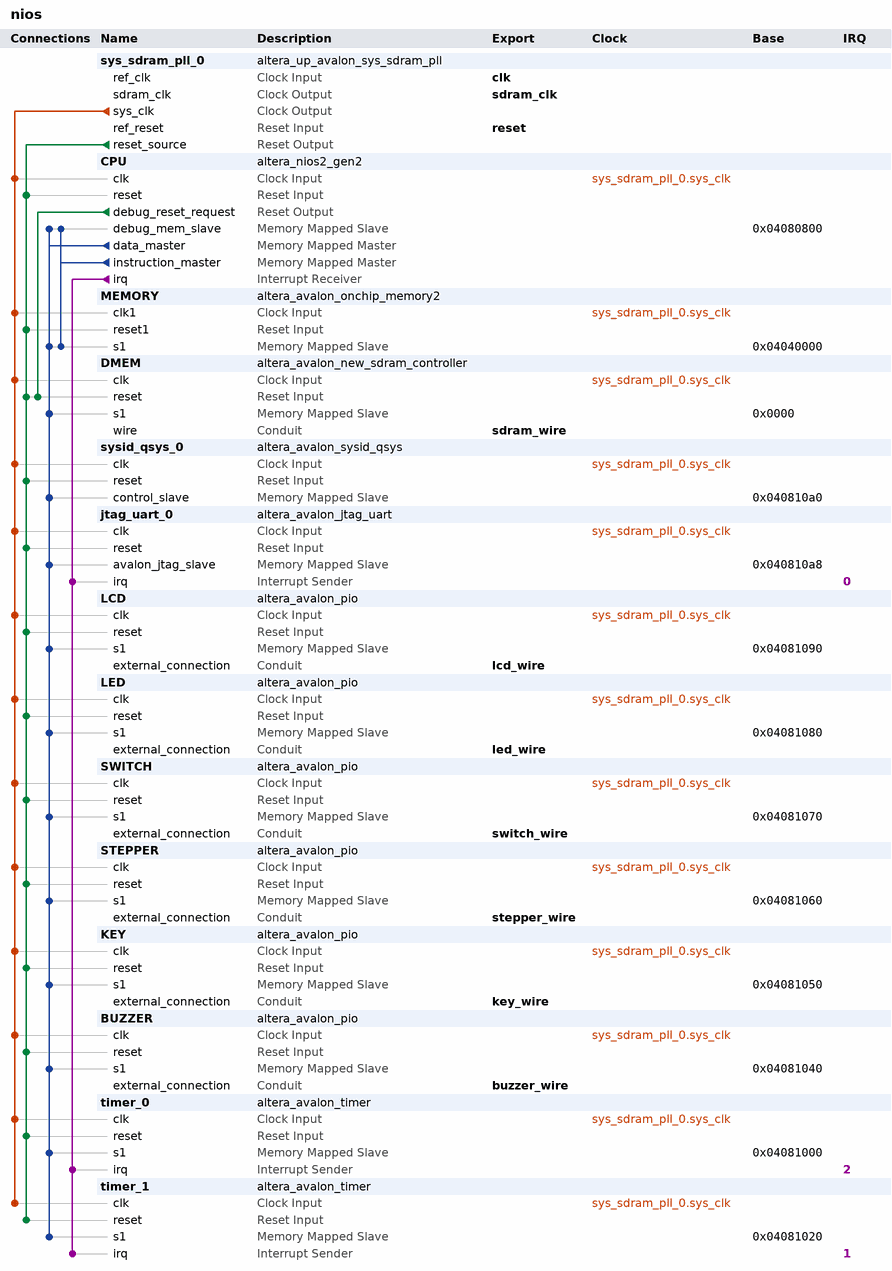
[diagram p0: system contents]
# Platform Designer (Qsys) system nios, Cyclone V 5CSXFC6D6F31C6
# Parameters at their usual value, and those the tool derives, are not listed.
package require -exact qsys 18.1
create_system nios
set_project_property DEVICE_FAMILY {Cyclone V}
set_project_property DEVICE 5CSXFC6D6F31C6

add_instance sys_sdram_pll_0 altera_up_avalon_sys_sdram_pll 18.0
set_instance_parameter_value sys_sdram_pll_0 CV_boards DE10-Standard
set_instance_parameter_value sys_sdram_pll_0 gui_outclk 50.0
set_instance_parameter_value sys_sdram_pll_0 gui_refclk 50.0

add_instance CPU altera_nios2_gen2 18.1
set_instance_parameter_value CPU dcache_size 2048
set_instance_parameter_value CPU exceptionSlave MEMORY.s1
set_instance_parameter_value CPU icache_size 4096
set_instance_parameter_value CPU impl Fast
set_instance_parameter_value CPU resetSlave MEMORY.s1

add_instance MEMORY altera_avalon_onchip_memory2 18.1
set_instance_parameter_value MEMORY dataWidth 32
set_instance_parameter_value MEMORY dualPort false
set_instance_parameter_value MEMORY initMemContent true
set_instance_parameter_value MEMORY initializationFileName onchip_mem.hex
set_instance_parameter_value MEMORY memorySize 204800

add_instance DMEM altera_avalon_new_sdram_controller 18.1
set_instance_parameter_value DMEM TAC 5.5
set_instance_parameter_value DMEM TRCD 20.0
set_instance_parameter_value DMEM TRP 20.0
set_instance_parameter_value DMEM casLatency 3
set_instance_parameter_value DMEM columnWidth 10
set_instance_parameter_value DMEM dataWidth 16
set_instance_parameter_value DMEM generateSimulationModel false
set_instance_parameter_value DMEM model single_Micron_MT48LC4M32B2_7_chip
set_instance_parameter_value DMEM numberOfBanks 4
set_instance_parameter_value DMEM numberOfChipSelects 1
set_instance_parameter_value DMEM powerUpDelay 100.0
set_instance_parameter_value DMEM refreshPeriod 15.625
set_instance_parameter_value DMEM rowWidth 13

add_instance sysid_qsys_0 altera_avalon_sysid_qsys 18.1
set_instance_parameter_value sysid_qsys_0 id 67637408

add_instance jtag_uart_0 altera_avalon_jtag_uart 18.1
set_instance_parameter_value jtag_uart_0 simInteractiveOptions NO_INTERACTIVE_WINDOWS

add_instance LCD altera_avalon_pio 18.1
set_instance_parameter_value LCD direction Output
set_instance_parameter_value LCD width 11

add_instance LED altera_avalon_pio 18.1
set_instance_parameter_value LED direction Output
set_instance_parameter_value LED width 10

add_instance SWITCH altera_avalon_pio 18.1
set_instance_parameter_value SWITCH direction Input
set_instance_parameter_value SWITCH width 10

add_instance STEPPER altera_avalon_pio 18.1
set_instance_parameter_value STEPPER direction Output
set_instance_parameter_value STEPPER width 4

add_instance KEY altera_avalon_pio 18.1
set_instance_parameter_value KEY direction Input
set_instance_parameter_value KEY width 4

add_instance BUZZER altera_avalon_pio 18.1
set_instance_parameter_value BUZZER direction Output
set_instance_parameter_value BUZZER width 1

add_instance timer_0 altera_avalon_timer 18.1
set_instance_parameter_value timer_0 period 1
set_instance_parameter_value timer_0 periodUnits MSEC

add_instance timer_1 altera_avalon_timer 18.1
set_instance_parameter_value timer_1 period 1
set_instance_parameter_value timer_1 periodUnits MSEC

# connections
add_connection sys_sdram_pll_0.sys_clk BUZZER.clk clock
add_connection sys_sdram_pll_0.sys_clk CPU.clk clock
add_connection sys_sdram_pll_0.sys_clk DMEM.clk clock
add_connection sys_sdram_pll_0.sys_clk jtag_uart_0.clk clock
add_connection sys_sdram_pll_0.sys_clk KEY.clk clock
add_connection sys_sdram_pll_0.sys_clk LCD.clk clock
add_connection sys_sdram_pll_0.sys_clk LED.clk clock
add_connection sys_sdram_pll_0.sys_clk MEMORY.clk1 clock
add_connection sys_sdram_pll_0.sys_clk STEPPER.clk clock
add_connection sys_sdram_pll_0.sys_clk SWITCH.clk clock
add_connection sys_sdram_pll_0.sys_clk sysid_qsys_0.clk clock
add_connection sys_sdram_pll_0.sys_clk timer_0.clk clock
add_connection sys_sdram_pll_0.sys_clk timer_1.clk clock
add_connection CPU.debug_reset_request DMEM.reset reset
add_connection sys_sdram_pll_0.reset_source BUZZER.reset reset
add_connection sys_sdram_pll_0.reset_source CPU.reset reset
add_connection sys_sdram_pll_0.reset_source DMEM.reset reset
add_connection sys_sdram_pll_0.reset_source jtag_uart_0.reset reset
add_connection sys_sdram_pll_0.reset_source KEY.reset reset
add_connection sys_sdram_pll_0.reset_source LCD.reset reset
add_connection sys_sdram_pll_0.reset_source LED.reset reset
add_connection sys_sdram_pll_0.reset_source MEMORY.reset1 reset
add_connection sys_sdram_pll_0.reset_source STEPPER.reset reset
add_connection sys_sdram_pll_0.reset_source SWITCH.reset reset
add_connection sys_sdram_pll_0.reset_source sysid_qsys_0.reset reset
add_connection sys_sdram_pll_0.reset_source timer_0.reset reset
add_connection sys_sdram_pll_0.reset_source timer_1.reset reset
add_connection CPU.data_master BUZZER.s1 avalon
set_connection_parameter_value CPU.data_master/BUZZER.s1 baseAddress 0x04081040
add_connection CPU.data_master CPU.debug_mem_slave avalon
set_connection_parameter_value CPU.data_master/CPU.debug_mem_slave baseAddress 0x04080800
add_connection CPU.data_master DMEM.s1 avalon
set_connection_parameter_value CPU.data_master/DMEM.s1 baseAddress 0x0000
add_connection CPU.data_master jtag_uart_0.avalon_jtag_slave avalon
set_connection_parameter_value CPU.data_master/jtag_uart_0.avalon_jtag_slave baseAddress 0x040810a8
add_connection CPU.data_master KEY.s1 avalon
set_connection_parameter_value CPU.data_master/KEY.s1 baseAddress 0x04081050
add_connection CPU.data_master LCD.s1 avalon
set_connection_parameter_value CPU.data_master/LCD.s1 baseAddress 0x04081090
add_connection CPU.data_master LED.s1 avalon
set_connection_parameter_value CPU.data_master/LED.s1 baseAddress 0x04081080
add_connection CPU.data_master MEMORY.s1 avalon
set_connection_parameter_value CPU.data_master/MEMORY.s1 baseAddress 0x04040000
add_connection CPU.data_master STEPPER.s1 avalon
set_connection_parameter_value CPU.data_master/STEPPER.s1 baseAddress 0x04081060
add_connection CPU.data_master SWITCH.s1 avalon
set_connection_parameter_value CPU.data_master/SWITCH.s1 baseAddress 0x04081070
add_connection CPU.data_master sysid_qsys_0.control_slave avalon
set_connection_parameter_value CPU.data_master/sysid_qsys_0.control_slave baseAddress 0x040810a0
add_connection CPU.data_master timer_0.s1 avalon
set_connection_parameter_value CPU.data_master/timer_0.s1 baseAddress 0x04081000
add_connection CPU.data_master timer_1.s1 avalon
set_connection_parameter_value CPU.data_master/timer_1.s1 baseAddress 0x04081020
add_connection CPU.instruction_master CPU.debug_mem_slave avalon
set_connection_parameter_value CPU.instruction_master/CPU.debug_mem_slave baseAddress 0x04080800
add_connection CPU.instruction_master MEMORY.s1 avalon
set_connection_parameter_value CPU.instruction_master/MEMORY.s1 baseAddress 0x04040000
add_connection CPU.irq jtag_uart_0.irq interrupt
set_connection_parameter_value CPU.irq/jtag_uart_0.irq irqNumber 0
add_connection CPU.irq timer_0.irq interrupt
set_connection_parameter_value CPU.irq/timer_0.irq irqNumber 2
add_connection CPU.irq timer_1.irq interrupt
set_connection_parameter_value CPU.irq/timer_1.irq irqNumber 1

# exported interfaces
add_interface buzzer_wire conduit end
set_interface_property buzzer_wire EXPORT_OF BUZZER.external_connection
add_interface clk clock sink
set_interface_property clk EXPORT_OF sys_sdram_pll_0.ref_clk
add_interface key_wire conduit end
set_interface_property key_wire EXPORT_OF KEY.external_connection
add_interface lcd_wire conduit end
set_interface_property lcd_wire EXPORT_OF LCD.external_connection
add_interface led_wire conduit end
set_interface_property led_wire EXPORT_OF LED.external_connection
add_interface reset reset sink
set_interface_property reset EXPORT_OF sys_sdram_pll_0.ref_reset
add_interface sdram_clk clock source
set_interface_property sdram_clk EXPORT_OF sys_sdram_pll_0.sdram_clk
add_interface sdram_wire conduit end
set_interface_property sdram_wire EXPORT_OF DMEM.wire
add_interface stepper_wire conduit end
set_interface_property stepper_wire EXPORT_OF STEPPER.external_connection
add_interface switch_wire conduit end
set_interface_property switch_wire EXPORT_OF SWITCH.external_connection

set_interconnect_requirement {$system} qsys_mm.clockCrossingAdapter HANDSHAKE
set_interconnect_requirement {$system} qsys_mm.enableEccProtection FALSE
set_interconnect_requirement {$system} qsys_mm.insertDefaultSlave FALSE
set_interconnect_requirement {$system} qsys_mm.maxAdditionalLatency 1

save_system nios.qsys
